# EAGLE design switch-eval (EAGLE 9.5.1)
AUTHOR: Krishna Makhija
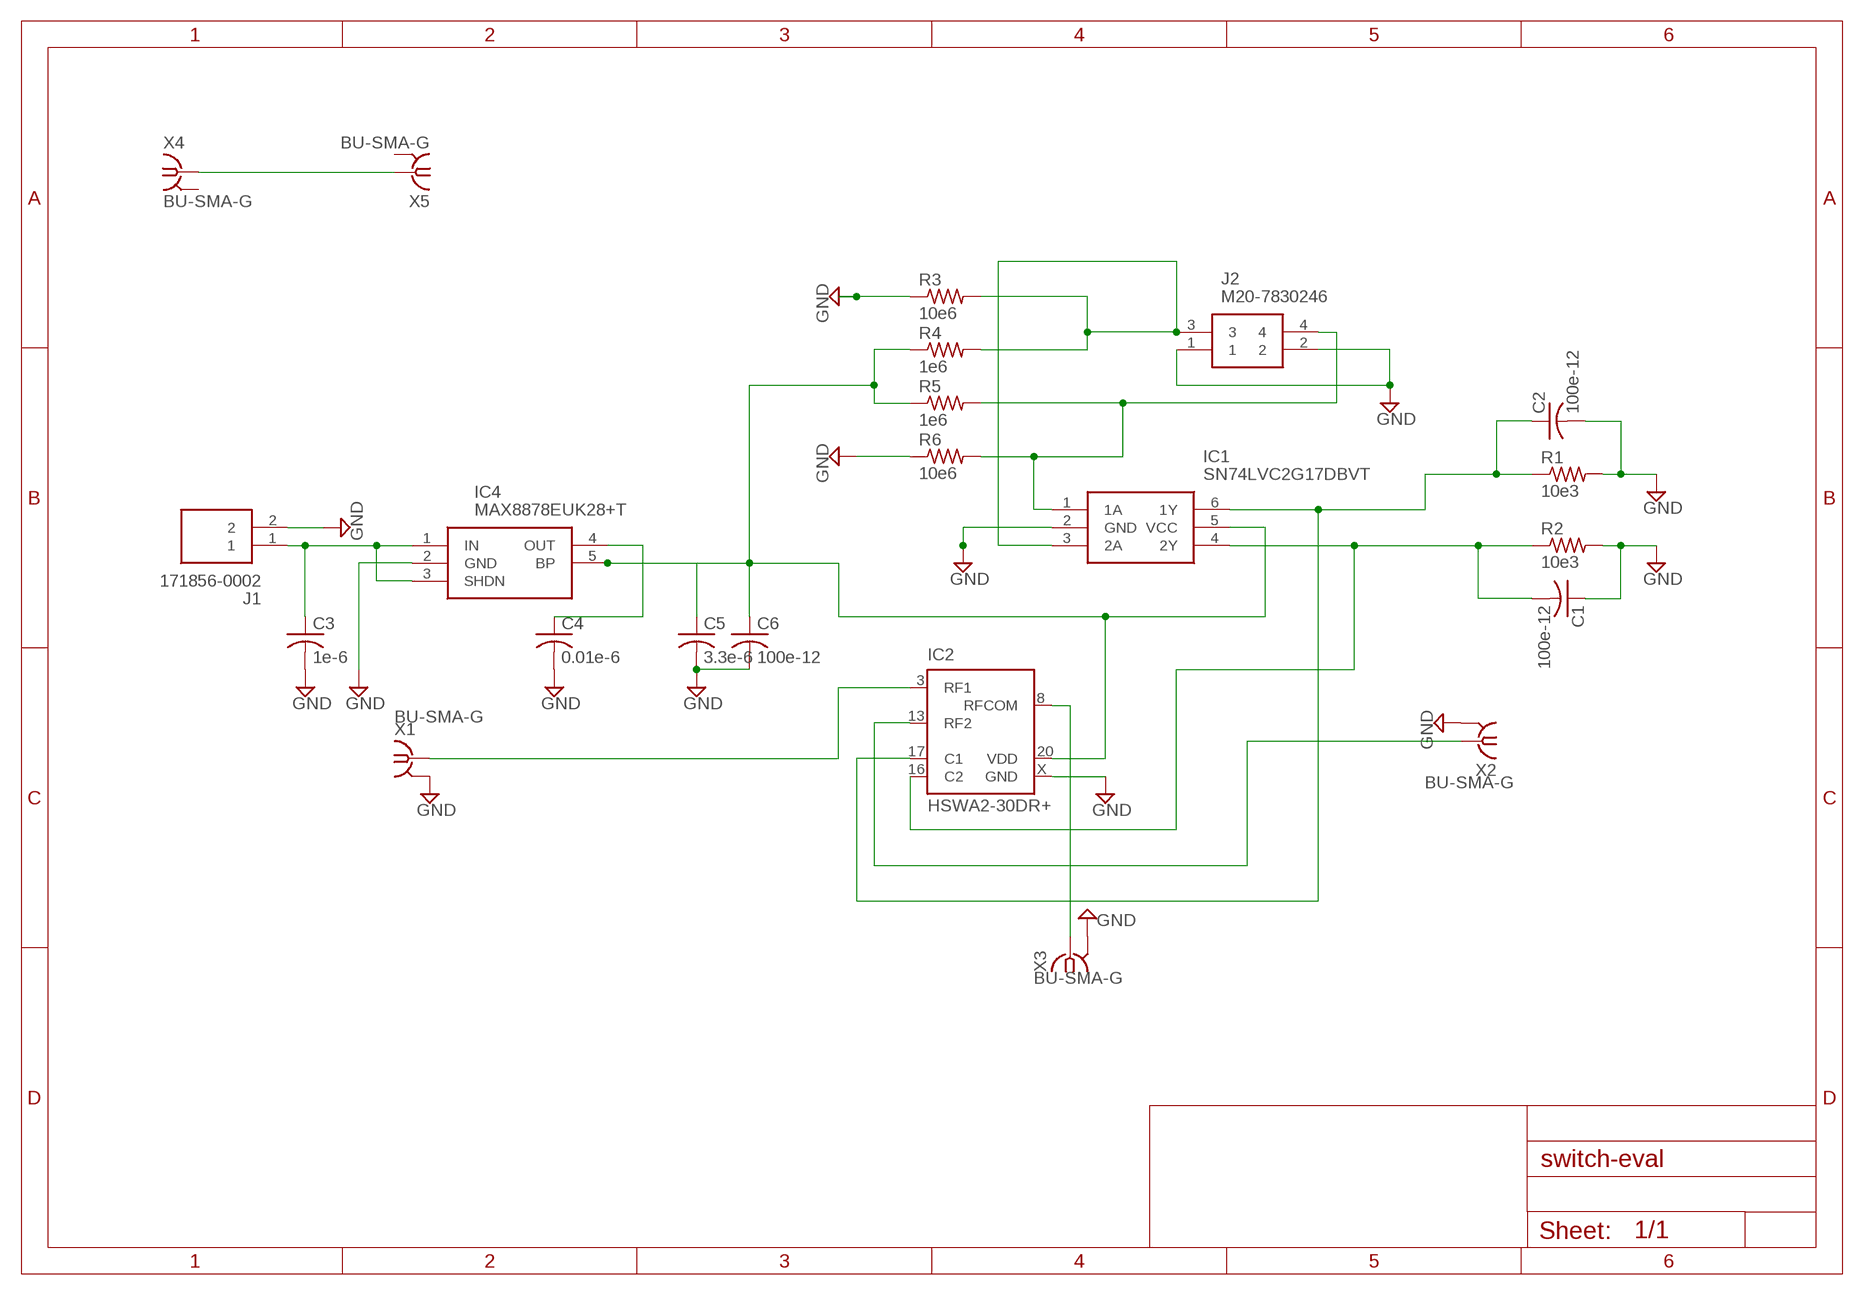
[diagram p0: schematic, sheet 1]

## Parts
C1  100e-12  C-USC0603  [C0603]
C2  100e-12  C-USC0603  [C0603]
C3  1e-6  C-USC0603  [C0603]
C4  0.01e-6  C-USC0603  [C0603]
C5  3.3e-6  C-USC0603  [C0603]
C6  100e-12  C-USC0603  [C0603]
IC1  SN74LVC2G17DBVT  [SOT95P280X145-6N]
IC2  HSWA2-30DR+  [DG983-1]
IC4  MAX8878EUK28+T  [SOT95P280X145-5N]
J1  171856-0002  [SHDR2W90P0X254_1X2_493X635X106]
J2  M20-7830246  [M207830246]
R1  10e3  R-US_R0603  [R0603]
R2  10e3  R-US_R0603  [R0603]
R3  10e6  R-US_R0603  [R0603]
R4  1e6  R-US_R0603  [R0603]
R5  1e6  R-US_R0603  [R0603]
R6  10e6  R-US_R0603  [R0603]
X1  BU-SMA-G  [BU-SMA-G]
X2  BU-SMA-G  [BU-SMA-G]
X3  BU-SMA-G  [BU-SMA-G]
X4  BU-SMA-G  [BU-SMA-G]
X5  BU-SMA-G  [BU-SMA-G]

## Nets
GND: C1.1 C2.2 C3.2 C4.2 C5.2 C6.2 IC1.2(GND) IC2.X(GND) IC4.2(GND) J1.2 J2.1 J2.2 R1.2 R2.2 R3.1 R6.1 X1.2 X1.3 X1.4 X1.5 X2.2 X2.3 X2.4 X2.5 X3.2 X3.3 X3.4 X3.5
N$1: IC1.3(2A) J2.3 R3.2 R4.2
N$2: C3.1 IC4.1(IN) IC4.3(SHDN) J1.1
N$3: C4.1 IC4.4(OUT)
N$4: IC1.1(1A) J2.4 R5.2 R6.2
N$5: X4.1 X5.1
N$7: C5.1 C6.1 IC1.5(VCC) IC2.20(VDD) IC4.5(BP) R4.1 R5.1
N$8: IC2.3(RF1) X1.1
N$9: C2.1 IC1.6(1Y) IC2.17(C1) R1.1
N$10: IC2.13(RF2) X2.1
N$11: C1.2 IC1.4(2Y) IC2.16(C2) R2.1
N$12: IC2.8(RFCOM) X3.1
Unconnected: X4.2 X4.3 X4.4 X4.5 X5.2 X5.3 X5.4 X5.5

## Power pins joined to a net without a drawn wire
GND: IC2.1(GND) IC2.2(GND) IC2.4(GND) IC2.5(GND) IC2.6(GND) IC2.7(GND) IC2.9(GND) IC2.10(GND) IC2.11(GND) IC2.12(GND) IC2.14(GND) IC2.15(GND) IC2.18(GND) IC2.19(GND)

## Library data of the parts
C1-C6 = rcl:C-US: CAPACITOR, American symbol; SPICEPREFIX: C
IC1 = SN74LVC2G17DBVT:SN74LVC2G17DBVT: DUAL SCHMITT-TRIGGER BUFFER Source: Datasheet <http://www.ti.com/lit/gpn/SN74LVC2G17>; DESCRIPTION: DUAL SCHMITT-TRIGGER BUFFER; HEIGHT: 1.45mm; MANUFACTURER_NAME: Texas Instruments; MANUFACTURER_PART_NUMBER: SN74LVC2G17DBVT; MOUSER_PART_NUMBER: 595-SN74LVC2G17DBVT; MOUSER_PRICE-STOCK: https://www.mouser.com/Search/Refine.aspx?Keyword=595-SN74LVC2G17DBVT; RS_PART_NUMBER: 6628944P; RS_PRICE-STOCK: http://uk.rs-online.com/web/p/products/6628944P
IC2 = minicircuits:HSWA2-30DR+: SPDT RF SWITCH Absorptive RF Switch with internal driver Source: http://www.minicircuits.com .. HSWA2-30DR+.pdf; OC_FARNELL: unknown; OC_NEWARK: unknown
IC4 = MAX8878EUK28+T:MAX8878EUK28+T: LDO Voltage Regulators Low-Noise, Low-Dropout, 150mA Linear Regulators with 2982 Pinout Source: Datasheet <https://www.mouser.com/datasheet/2/256/MAX8878-1389229.pdf>; DESCRIPTION: LDO Voltage Regulators Low-Noise, Low-Dropout, 150mA Linear Regulators with 2982 Pinout; HEIGHT: 1.45mm; MANUFACTURER_NAME: Maxim Integrated; MANUFACTURER_PART_NUMBER: MAX8878EUK28+T
J1 = 171856-0002:171856-0002: KK 254 RPC Pin Header friction lock 2way Molex KK 254 Series, Series Number 171856, 2.54mm Pitch 2 Way 1 Row Straight PCB Header, Through Hole Source: Datasheet <https://www.digikey.com/product-detail/en/molex/1718560002/WM10153-ND/4423109>; ALLIED_NUMBER: 70314268; ALLIED_PRICE-STOCK: https://www.alliedelec.com/molexincorporated-171856-0002/70314268/; DESCRIPTION: KK 254 RPC Pin Header friction lock 2way Molex KK 254 Series, Series Number 171856, 2.54mm Pitch 2 Way 1 Row Straight PCB Header, Through Hole; HEIGHT: 10.61mm; MANUFACTURER_NAME: Molex; MANUFACTURER_PART_NUMBER: 171856-0002; MOUSER_PART_NUMBER: 538-171856-0002; MOUSER_PRICE-STOCK: https://www.mouser.com/Search/Refine.aspx?Keyword=538-171856-0002; RS_PART_NUMBER: 7922884P; RS_PRICE-STOCK: http://uk.rs-online.com/web/p/products/7922884P
J2 = M20-7830246:M20-7830246: HARWIN 2.54mm 4 Way 2 Row Straight PCB Socket Through Hole Socket Strip Source: Datasheet <https://cdn.harwin.com/pdfs/M20-783.pdf>; ALLIED_NUMBER: R1052762; ALLIED_PRICE-STOCK: https://www.alliedelec.com/harwin-m20-7830246/R1052762/; DESCRIPTION: HARWIN 2.54mm 4 Way 2 Row Straight PCB Socket Through Hole Socket Strip; HEIGHT: 8.65mm; MANUFACTURER_NAME: HARWIN; MANUFACTURER_PART_NUMBER: M20-7830246; MOUSER_PART_NUMBER: 855-M20-7830246; MOUSER_PRICE-STOCK: https://www.mouser.com/Search/Refine.aspx?Keyword=855-M20-7830246; RS_PART_NUMBER: 6816839P; RS_PRICE-STOCK: http://uk.rs-online.com/web/p/products/6816839P
R1-R6 = rcl:R-US_: RESISTOR, American symbol; SPICEPREFIX: R
X1-X5 = con-coax:BU-SMA-G: FEMALE SMA CONNECTOR Radiall distributor RS 193-9117; OC_FARNELL: unknown; OC_NEWARK: unknown

## Board
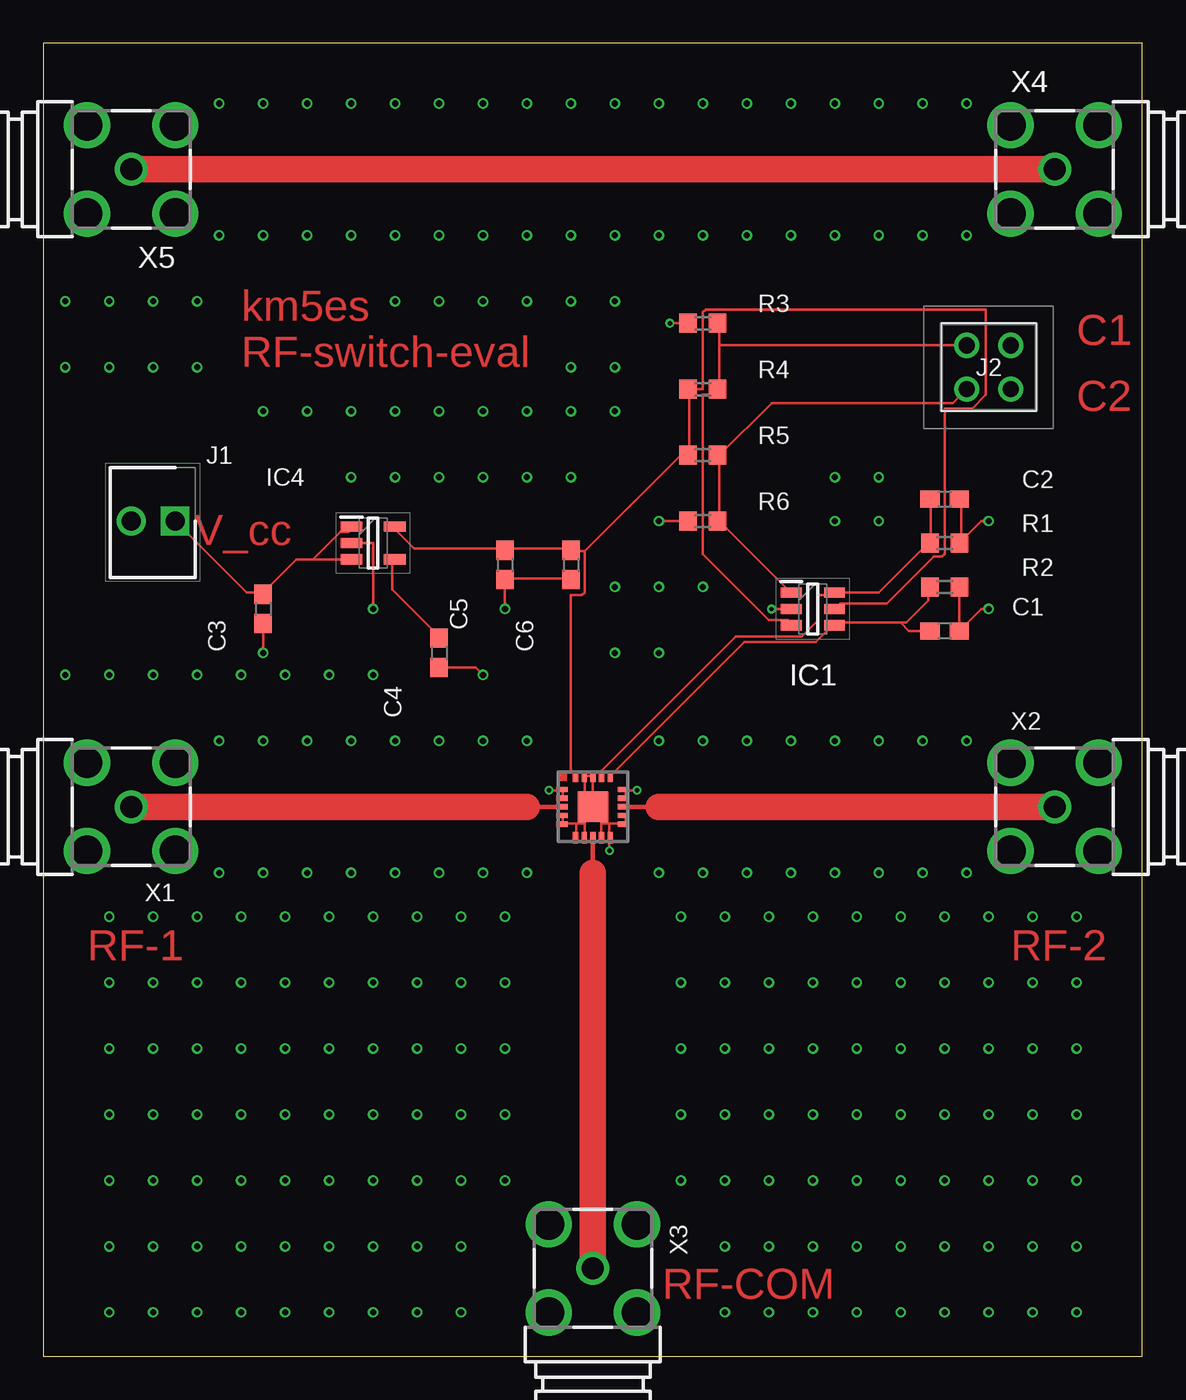
[diagram p1: board, top side]
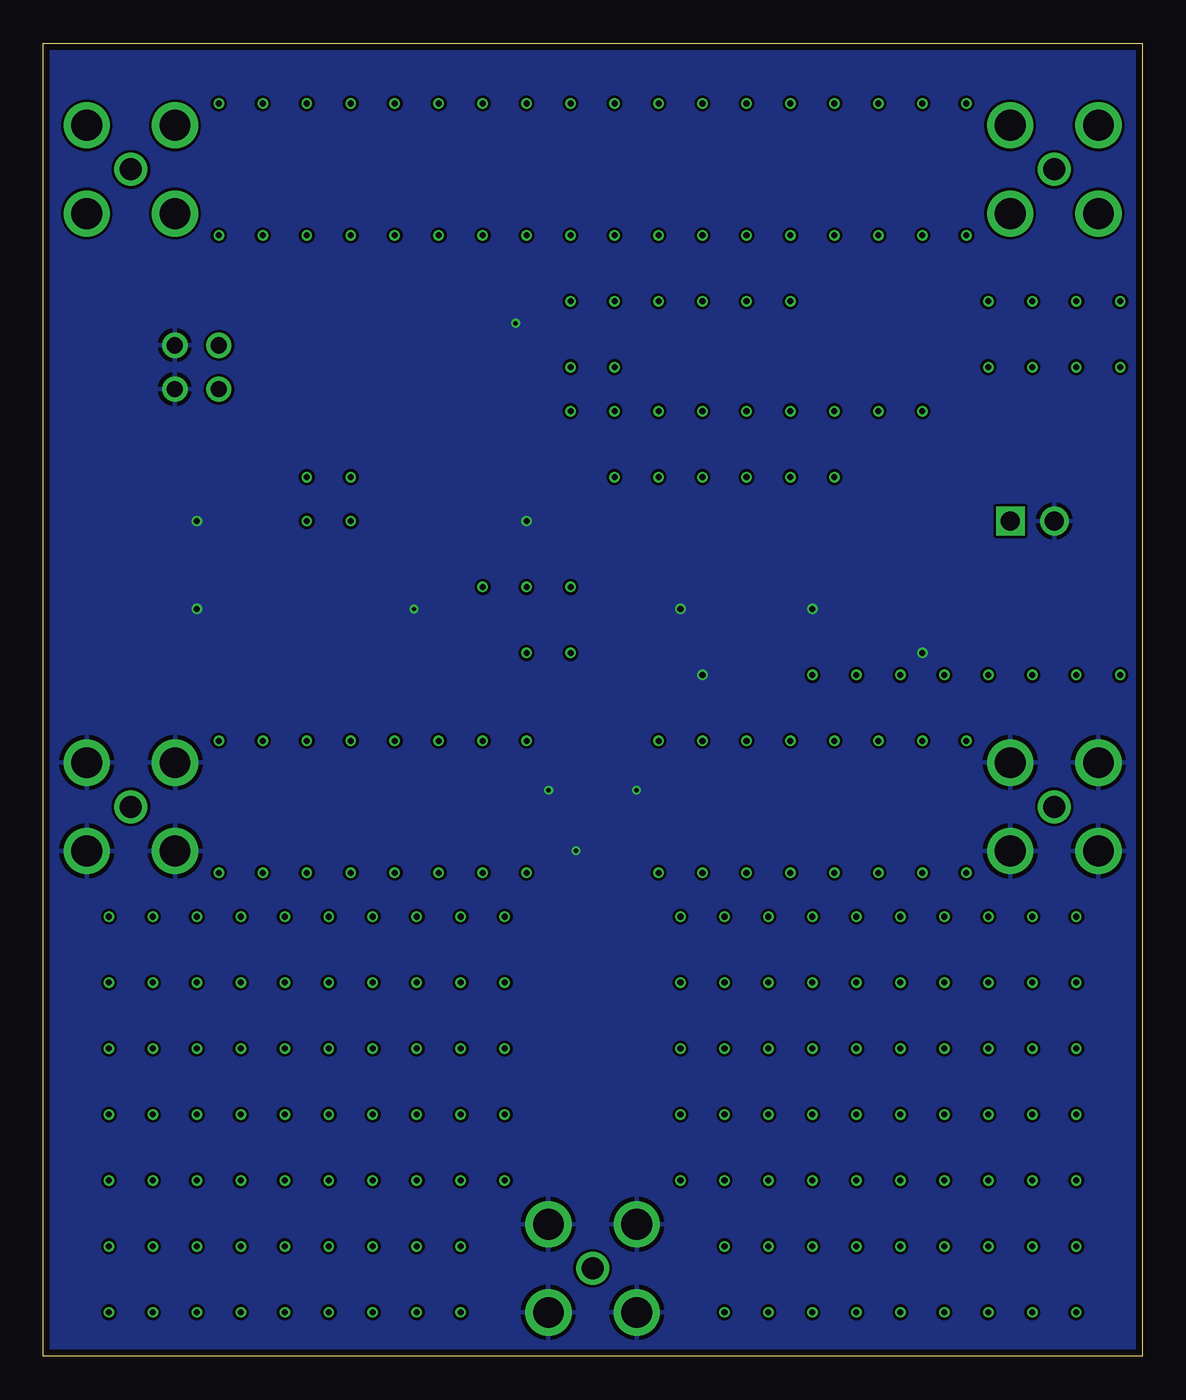
[diagram p2: board, bottom side, seen from below]

Size 63.48 x 75.87 mm. Coordinates in mm from the lower left corner, seen from the top.
Outline: 0,0 63.48,0 63.48,75.87 0,75.87 0,0
Copper layers (1*16): Top 0.035559375mm / dielectric 1.6mm / Bottom 0.035559375mm
Design rules "oshpark-2layer": minimum track width 6mil, minimum drill 10mil, track to track 6mil, track to pad 6mil, pad to pad 6mil, via to via 6mil, smd to smd 6mil, copper to edge 15mil, drill to drill 6mil, minimum pad ring 5mil, minimum via ring 5mil, stop-mask expansion 2.5mil, vias tented up to drill 0mil, thermal gap 10mil

### Footprints (pad centres in the part's own frame; a part is rotated, then mirrored left to right if it is on the bottom)
C0603 = smd 1.1 x 1: 1 -0.85,0; 2 0.85,0
SOT95P280X145-6N = smd 1.2 x 0.6: 1 -1.25,0.95; 2 -1.25,0; 3 -1.25,-0.95; 4 1.25,-0.95; 5 1.25,0; 6 1.25,0.95
DG983-1 = smd 0.66 x 0.31: 1 -1.775,1; 2 -1.775,0.5; 3 -1.775,0; 4 -1.775,-0.5; 5 -1.775,-1; 11 1.775,-1; 12 1.775,-0.5; 13 1.775,0; 14 1.775,0.5; 15 1.775,1 | smd 0.31 x 0.66: 6 -1,-1.775; 7 -0.5,-1.775; 8 0,-1.775; 9 0.5,-1.775; 10 1,-1.775; 16 1,1.775; 17 0.5,1.775; 18 0,1.775; 19 -0.5,1.775; 20 -1,1.775 | smd 1.78 x 1.78: X 0,0
SOT95P280X145-5N = smd 1.25 x 0.6: 1 -1.25,0.95; 2 -1.25,0; 3 -1.25,-0.95; 4 1.25,-0.95; 5 1.25,0.95
SHDR2W90P0X254_1X2_493X635X106 = drill 1.1 pad 1.65 square: 1 0,0 | drill 1.1 pad 1.65: 2 2.54,0
M207830246 = drill 0.94 pad 1.462: 1 -1.27,-1.27; 2 -1.27,1.27; 3 1.27,-1.27; 4 1.27,1.27
R0603 = smd 1 x 1.1: 1 -0.85,0; 2 0.85,0
BU-SMA-G = drill 1.27: 1 0,0 | drill 1.778: 2 -2.55,2.55; 3 2.55,2.55; 4 2.55,-2.55; 5 -2.55,-2.55

### Placement (x,y rotation side)
C1  52.07,41.91 180 top
C2  52.07,49.53 0 top
C3  12.7,43.18 270 top
C4  22.86,40.64 270 top
C5  26.67,45.72 270 top
C6  30.48,45.72 270 top
IC1  44.45,43.18 0 top
IC2  31.75,31.75 0 top
IC4  19.05,46.99 0 top
J1  7.62,48.26 180 top
J2  54.61,57.15 180 top
R1  52.07,46.99 0 top
R2  52.07,44.45 0 top
R3  38.1,59.69 0 top
R4  38.1,55.88 0 top
R5  38.1,52.07 0 top
R6  38.1,48.26 0 top
X1  5.08,31.75 180 top
X2  58.42,31.75 0 top
X3  31.75,5.08 270 top
X4  58.42,68.58 0 top
X5  5.08,68.58 180 top

### Tracks (layer width: path | path; a pad name or v marks a point on that pad's centre or on a via)
GND  (via drill 0.25, 0.35)
  Top 0.152: IC2.12 33.66,31.11 33.66,30.8 IC2.11 33.5,30.8 32.7,30.8 | 32.7,30.8 32.7,30 IC2.10 32.7,29.84 v32.7,29.21 | 30,30.8 30,31.11 IC2.4 | 30.8,30.8 30.8,30 IC2.6 | 30,30.8 30.8,30.8 | 30,30.8 IC2.5 | IC2.X IC2.18 IC2.19 31.27,33.5 31.27,31.75 | 31.27,31.75 31.27,30.8 | 31.27,30.8 31.27,30 IC2.7 | 32.23,30.8 32.23,31.75 IC2.X | 32.23,30.8 32.23,30 IC2.9 | 31.27,31.75 IC2.X | 31.27,30.8 30.8,30.8 | 32.23,30.8 32.7,30.8 | 33.66,32.7 33.66,32.38 IC2.14 | IC2.2 30,32.38 30,32.7 IC2.1 29.84,32.7 v29.21,32.7 | v34.29,32.7 33.66,32.7 | 33.66,32.7 IC2.15 | 12.7,42.23 C3.2 v12.7,40.64 | 22.86,39.85 C4.2 24.98,39.79 v25.4,39.37 | C6.2 30.48,44.93 26.67,44.93 C5.2 v26.67,43.18 | 17.94,46.99 IC4.2 19.05,46.99 v19.05,43.18 | 53.02,49.53 C2.2 53.02,49.43 53.02,47.09 R1.2 54.19,48.26 v54.61,48.26 | 53.02,44.45 R2.2 C1.1 54.19,43.18 v54.61,43.18 | 37.15,48.26 R6.1 v35.56,48.26 | v36.2,59.69 R3.1 | v42.07,43.18 IC1.2
  pour Bottom: 0,76.2 63.5,76.2 63.5,0 0,0
N$1
  Top 0.152: 39.05,58.42 39.05,59.69 R3.2 | 39.05,58.42 39.05,55.88 R4.2 38.89,55.88 38.58,55.56 38.1,55.56 38.1,46.35 41.91,42.55 43.02,42.55 43.18,42.39 IC1.3 | 39.05,58.42 J2.3
N$2
  Top 0.152: 12.7,44.13 14.61,46.04 15.56,46.04 | 15.56,46.04 17.78,46.04 IC4.3 | 15.56,46.04 17.14,47.62 17.62,47.62 17.78,47.78 IC4.1 | J1.1 11.75,44.13 12.7,44.13 | 12.7,44.13 C3.1
N$3
  Top 0.152: C4.1 22.86,41.59 20.16,44.29 20.16,46.04 IC4.4
N$4
  Top 0.152: 39.05,52.07 39.05,48.26 | 39.05,48.26 43.18,44.13 IC1.1 | 39.05,48.26 R6.2 | J2.4 52.55,55.09 42.07,55.09 39.05,52.07 | 39.05,52.07 R5.2
N$5
  Top 1.524: X5.1 X4.1
N$6  (via drill 0.35)
  other vias: 10.16,27.94
N$7
  Top 0.152: IC2.20 30.64,33.66 30.48,33.81 30.48,43.97 31.11,43.97 31.27,44.13 31.27,46.51 | 31.27,46.51 30.48,46.51 C6.1 30.48,46.67 26.67,46.67 | 26.67,46.67 21.43,46.67 20.32,47.78 IC4.5 | 26.67,46.67 C5.1 | 37.31,55.88 37.31,52.07 R5.1 36.83,52.07 31.27,46.51 | 37.31,55.88 38.1,55.88 38.1,60.33 38.26,60.48 54.45,60.48 54.45,55.56 53.66,54.77 52.07,54.77 52.07,46.35 51.91,46.2 51.44,46.2 48.74,43.5 46.04,43.5 45.72,43.18 IC1.5 | 37.31,55.88 R4.1
N$8
  Top 0.254: IC2.3 27.94,31.75
  Top 1.524: 27.94,31.75 X1.1
N$9
  Top 0.152: 32.23,33.81 32.23,33.66 IC2.17 32.23,33.81 | C2.1 51.28,49.53 51.28,46.99 R1.1 51.12,46.99 48.26,44.13 45.72,44.13 IC1.6 45.56,43.97 44.77,43.97 44.77,42.55 43.81,41.59 40.01,41.59 32.23,33.81
N$10
  Top 0.254: IC2.13 35.56,31.75
  Top 1.524: 35.56,31.75 X2.1
N$11
  Top 0.152: R2.1 51.12,44.45 51.12,43.66 49.85,42.39 49.53,42.39 | IC2.16 32.86,33.66 40.48,41.27 44.61,41.27 45.56,42.23 IC1.4 45.72,42.39 49.53,42.39 | C1.2 50.01,41.91 49.53,42.39
N$12
  Top 0.254: 31.75,27.94 IC2.8
  Top 1.524: X3.1 31.75,27.94
N$13  (via drill 0.35)
  other vias: 12.7,27.94
N$14  (via drill 0.35)
  other vias: 15.24,27.94
N$15  (via drill 0.35)
  other vias: 17.78,27.94
N$16  (via drill 0.35)
  other vias: 20.32,27.94
N$17  (via drill 0.35)
  other vias: 22.86,27.94
N$18  (via drill 0.35)
  other vias: 25.4,27.94
N$19  (via drill 0.35)
  other vias: 27.94,27.94
N$20  (via drill 0.35)
  other vias: 1.27,60.96
N$21  (via drill 0.35)
  other vias: 3.81,25.4
N$22  (via drill 0.35)
  other vias: 6.35,25.4
N$23  (via drill 0.35)
  other vias: 8.89,25.4
N$24  (via drill 0.35)
  other vias: 11.43,25.4
N$25  (via drill 0.35)
  other vias: 13.97,25.4
N$26  (via drill 0.35)
  other vias: 16.51,25.4
N$27  (via drill 0.35)
  other vias: 19.05,25.4
N$28  (via drill 0.35)
  other vias: 3.81,60.96
N$29  (via drill 0.35)
  other vias: 3.81,21.59
N$30  (via drill 0.35)
  other vias: 6.35,21.59
N$31  (via drill 0.35)
  other vias: 8.89,21.59
N$32  (via drill 0.35)
  other vias: 11.43,21.59
N$33  (via drill 0.35)
  other vias: 13.97,21.59
N$34  (via drill 0.35)
  other vias: 16.51,21.59
N$35  (via drill 0.35)
  other vias: 19.05,21.59
N$36  (via drill 0.35)
  other vias: 6.35,60.96
N$37  (via drill 0.35)
  other vias: 3.81,17.78
N$38  (via drill 0.35)
  other vias: 6.35,17.78
N$39  (via drill 0.35)
  other vias: 8.89,17.78
N$40  (via drill 0.35)
  other vias: 11.43,17.78
N$41  (via drill 0.35)
  other vias: 13.97,17.78
N$42  (via drill 0.35)
  other vias: 16.51,17.78
N$43  (via drill 0.35)
  other vias: 19.05,17.78
N$44  (via drill 0.35)
  other vias: 8.89,60.96
N$45  (via drill 0.35)
  other vias: 3.81,13.97
N$46  (via drill 0.35)
  other vias: 6.35,13.97
N$47  (via drill 0.35)
  other vias: 8.89,13.97
N$48  (via drill 0.35)
  other vias: 11.43,13.97
N$49  (via drill 0.35)
  other vias: 13.97,13.97
N$50  (via drill 0.35)
  other vias: 16.51,13.97
N$51  (via drill 0.35)
  other vias: 19.05,13.97
N$52  (via drill 0.35)
  other vias: 1.27,57.15
N$53  (via drill 0.35)
  other vias: 3.81,10.16
N$54  (via drill 0.35)
  other vias: 6.35,10.16
N$55  (via drill 0.35)
  other vias: 8.89,10.16
N$56  (via drill 0.35)
  other vias: 11.43,10.16
N$57  (via drill 0.35)
  other vias: 13.97,10.16
N$58  (via drill 0.35)
  other vias: 16.51,10.16
N$59  (via drill 0.35)
  other vias: 19.05,10.16
N$60  (via drill 0.35)
  other vias: 3.81,57.15
N$61  (via drill 0.35)
  other vias: 3.81,6.35
N$62  (via drill 0.35)
  other vias: 6.35,6.35
N$63  (via drill 0.35)
  other vias: 8.89,6.35
N$64  (via drill 0.35)
  other vias: 11.43,6.35
N$65  (via drill 0.35)
  other vias: 13.97,6.35
N$66  (via drill 0.35)
  other vias: 16.51,6.35
N$67  (via drill 0.35)
  other vias: 19.05,6.35
N$68  (via drill 0.35)
  other vias: 6.35,57.15
N$69  (via drill 0.35)
  other vias: 3.81,2.54
N$70  (via drill 0.35)
  other vias: 6.35,2.54
N$71  (via drill 0.35)
  other vias: 8.89,2.54
N$72  (via drill 0.35)
  other vias: 11.43,2.54
N$73  (via drill 0.35)
  other vias: 13.97,2.54
N$74  (via drill 0.35)
  other vias: 16.51,2.54
N$75  (via drill 0.35)
  other vias: 19.05,2.54
N$76  (via drill 0.35)
  other vias: 21.59,25.4
N$77  (via drill 0.35)
  other vias: 21.59,21.59
N$78  (via drill 0.35)
  other vias: 21.59,17.78
N$79  (via drill 0.35)
  other vias: 21.59,13.97
N$80  (via drill 0.35)
  other vias: 21.59,10.16
N$81  (via drill 0.35)
  other vias: 21.59,6.35
N$82  (via drill 0.35)
  other vias: 21.59,2.54
N$83  (via drill 0.35)
  other vias: 24.13,25.4
N$84  (via drill 0.35)
  other vias: 24.13,21.59
N$85  (via drill 0.35)
  other vias: 24.13,17.78
N$86  (via drill 0.35)
  other vias: 24.13,13.97
N$87  (via drill 0.35)
  other vias: 24.13,10.16
N$88  (via drill 0.35)
  other vias: 24.13,6.35
N$89  (via drill 0.35)
  other vias: 24.13,2.54
N$90  (via drill 0.35)
  other vias: 26.67,25.4
N$91  (via drill 0.35)
  other vias: 26.67,21.59
N$92  (via drill 0.35)
  other vias: 26.67,17.78
N$93  (via drill 0.35)
  other vias: 26.67,13.97
N$94  (via drill 0.35)
  other vias: 26.67,10.16
N$95  (via drill 0.35)
  other vias: 35.56,27.94
N$96  (via drill 0.35)
  other vias: 38.1,27.94
N$97  (via drill 0.35)
  other vias: 40.64,27.94
N$98  (via drill 0.35)
  other vias: 43.18,27.94
N$99  (via drill 0.35)
  other vias: 45.72,27.94
N$100  (via drill 0.35)
  other vias: 48.26,27.94
N$101  (via drill 0.35)
  other vias: 50.8,27.94
N$102  (via drill 0.35)
  other vias: 53.34,27.94
N$103  (via drill 0.35)
  other vias: 36.83,25.4
N$104  (via drill 0.35)
  other vias: 36.83,21.59
N$105  (via drill 0.35)
  other vias: 36.83,17.78
N$106  (via drill 0.35)
  other vias: 36.83,13.97
N$107  (via drill 0.35)
  other vias: 36.83,10.16
N$108  (via drill 0.35)
  other vias: 39.37,25.4
N$109  (via drill 0.35)
  other vias: 41.91,25.4
N$110  (via drill 0.35)
  other vias: 44.45,25.4
N$111  (via drill 0.35)
  other vias: 46.99,25.4
N$112  (via drill 0.35)
  other vias: 49.53,25.4
N$113  (via drill 0.35)
  other vias: 52.07,25.4
N$114  (via drill 0.35)
  other vias: 54.61,25.4
N$115  (via drill 0.35)
  other vias: 57.15,25.4
N$116  (via drill 0.35)
  other vias: 39.37,21.59
N$117  (via drill 0.35)
  other vias: 41.91,21.59
N$118  (via drill 0.35)
  other vias: 44.45,21.59
N$119  (via drill 0.35)
  other vias: 46.99,21.59
N$120  (via drill 0.35)
  other vias: 49.53,21.59
N$121  (via drill 0.35)
  other vias: 52.07,21.59
N$122  (via drill 0.35)
  other vias: 54.61,21.59
N$123  (via drill 0.35)
  other vias: 57.15,21.59
N$124  (via drill 0.35)
  other vias: 39.37,17.78
N$125  (via drill 0.35)
  other vias: 41.91,17.78
N$126  (via drill 0.35)
  other vias: 44.45,17.78
N$127  (via drill 0.35)
  other vias: 46.99,17.78
N$128  (via drill 0.35)
  other vias: 49.53,17.78
N$129  (via drill 0.35)
  other vias: 52.07,17.78
N$130  (via drill 0.35)
  other vias: 54.61,17.78
N$131  (via drill 0.35)
  other vias: 57.15,17.78
N$132  (via drill 0.35)
  other vias: 39.37,13.97
N$133  (via drill 0.35)
  other vias: 41.91,13.97
N$134  (via drill 0.35)
  other vias: 44.45,13.97
N$135  (via drill 0.35)
  other vias: 46.99,13.97
N$136  (via drill 0.35)
  other vias: 49.53,13.97
N$137  (via drill 0.35)
  other vias: 52.07,13.97
N$138  (via drill 0.35)
  other vias: 54.61,13.97
N$139  (via drill 0.35)
  other vias: 57.15,13.97
N$140  (via drill 0.35)
  other vias: 39.37,10.16
N$141  (via drill 0.35)
  other vias: 41.91,10.16
N$142  (via drill 0.35)
  other vias: 44.45,10.16
N$143  (via drill 0.35)
  other vias: 46.99,10.16
N$144  (via drill 0.35)
  other vias: 49.53,10.16
N$145  (via drill 0.35)
  other vias: 52.07,10.16
N$146  (via drill 0.35)
  other vias: 54.61,10.16
N$147  (via drill 0.35)
  other vias: 57.15,10.16
N$148  (via drill 0.35)
  other vias: 39.37,6.35
N$149  (via drill 0.35)
  other vias: 41.91,6.35
N$150  (via drill 0.35)
  other vias: 44.45,6.35
N$151  (via drill 0.35)
  other vias: 46.99,6.35
N$152  (via drill 0.35)
  other vias: 49.53,6.35
N$153  (via drill 0.35)
  other vias: 52.07,6.35
N$154  (via drill 0.35)
  other vias: 54.61,6.35
N$155  (via drill 0.35)
  other vias: 57.15,6.35
N$156  (via drill 0.35)
  other vias: 39.37,2.54
N$157  (via drill 0.35)
  other vias: 41.91,2.54
N$158  (via drill 0.35)
  other vias: 44.45,2.54
N$159  (via drill 0.35)
  other vias: 46.99,2.54
N$160  (via drill 0.35)
  other vias: 49.53,2.54
N$161  (via drill 0.35)
  other vias: 52.07,2.54
N$162  (via drill 0.35)
  other vias: 54.61,2.54
N$163  (via drill 0.35)
  other vias: 57.15,2.54
N$164  (via drill 0.35)
  other vias: 59.69,25.4
N$165  (via drill 0.35)
  other vias: 59.69,21.59
N$166  (via drill 0.35)
  other vias: 59.69,17.78
N$167  (via drill 0.35)
  other vias: 59.69,13.97
N$168  (via drill 0.35)
  other vias: 59.69,10.16
N$169  (via drill 0.35)
  other vias: 59.69,6.35
N$170  (via drill 0.35)
  other vias: 59.69,2.54
N$171  (via drill 0.35)
  other vias: 8.89,57.15
N$172  (via drill 0.35)
  other vias: 20.32,60.96
N$173  (via drill 0.35)
  other vias: 22.86,60.96
N$174  (via drill 0.35)
  other vias: 25.4,60.96
N$175  (via drill 0.35)
  other vias: 27.94,60.96
N$176  (via drill 0.35)
  other vias: 12.7,54.61
N$177  (via drill 0.35)
  other vias: 15.24,54.61
N$178  (via drill 0.35)
  other vias: 10.16,35.56
N$179  (via drill 0.35)
  other vias: 12.7,35.56
N$180  (via drill 0.35)
  other vias: 15.24,35.56
N$181  (via drill 0.35)
  other vias: 17.78,35.56
N$182  (via drill 0.35)
  other vias: 20.32,35.56
N$183  (via drill 0.35)
  other vias: 22.86,35.56
N$184  (via drill 0.35)
  other vias: 25.4,35.56
N$185  (via drill 0.35)
  other vias: 27.94,35.56
N$186  (via drill 0.35)
  other vias: 35.56,35.56
N$187  (via drill 0.35)
  other vias: 38.1,35.56
N$188  (via drill 0.35)
  other vias: 40.64,35.56
N$189  (via drill 0.35)
  other vias: 43.18,35.56
N$190  (via drill 0.35)
  other vias: 45.72,35.56
N$191  (via drill 0.35)
  other vias: 48.26,35.56
N$192  (via drill 0.35)
  other vias: 50.8,35.56
N$193  (via drill 0.35)
  other vias: 53.34,35.56
N$194  (via drill 0.35)
  other vias: 10.16,72.39
N$195  (via drill 0.35)
  other vias: 12.7,72.39
N$196  (via drill 0.35)
  other vias: 15.24,72.39
N$197  (via drill 0.35)
  other vias: 17.78,72.39
N$198  (via drill 0.35)
  other vias: 20.32,72.39
N$199  (via drill 0.35)
  other vias: 22.86,72.39
N$200  (via drill 0.35)
  other vias: 25.4,72.39
N$201  (via drill 0.35)
  other vias: 27.94,72.39
N$202  (via drill 0.35)
  other vias: 30.48,72.39
N$203  (via drill 0.35)
  other vias: 33.02,72.39
N$204  (via drill 0.35)
  other vias: 35.56,72.39
N$205  (via drill 0.35)
  other vias: 38.1,72.39
N$206  (via drill 0.35)
  other vias: 40.64,72.39
N$207  (via drill 0.35)
  other vias: 43.18,72.39
N$208  (via drill 0.35)
  other vias: 45.72,72.39
N$209  (via drill 0.35)
  other vias: 48.26,72.39
N$210  (via drill 0.35)
  other vias: 10.16,64.77
N$211  (via drill 0.35)
  other vias: 12.7,64.77
N$212  (via drill 0.35)
  other vias: 15.24,64.77
N$213  (via drill 0.35)
  other vias: 17.78,64.77
N$214  (via drill 0.35)
  other vias: 20.32,64.77
N$215  (via drill 0.35)
  other vias: 22.86,64.77
N$216  (via drill 0.35)
  other vias: 25.4,64.77
N$217  (via drill 0.35)
  other vias: 27.94,64.77
N$218  (via drill 0.35)
  other vias: 30.48,64.77
N$219  (via drill 0.35)
  other vias: 33.02,64.77
N$220  (via drill 0.35)
  other vias: 35.56,64.77
N$221  (via drill 0.35)
  other vias: 38.1,64.77
N$222  (via drill 0.35)
  other vias: 40.64,64.77
N$223  (via drill 0.35)
  other vias: 43.18,64.77
N$224  (via drill 0.35)
  other vias: 45.72,64.77
N$225  (via drill 0.35)
  other vias: 48.26,64.77
N$226  (via drill 0.35)
  other vias: 50.8,72.39
N$227  (via drill 0.35)
  other vias: 53.34,72.39
N$228  (via drill 0.35)
  other vias: 50.8,64.77
N$229  (via drill 0.35)
  other vias: 53.34,64.77
N$230  (via drill 0.35)
  other vias: 17.78,54.61
N$231  (via drill 0.35)
  other vias: 20.32,54.61
N$232  (via drill 0.35)
  other vias: 22.86,54.61
N$233  (via drill 0.35)
  other vias: 25.4,54.61
N$234  (via drill 0.35)
  other vias: 27.94,54.61
N$235  (via drill 0.35)
  other vias: 30.48,54.61
N$236  (via drill 0.35)
  other vias: 1.27,39.37
N$237  (via drill 0.35)
  other vias: 3.81,39.37
N$238  (via drill 0.35)
  other vias: 6.35,39.37
N$239  (via drill 0.35)
  other vias: 8.89,39.37
N$240  (via drill 0.35)
  other vias: 11.43,39.37
N$241  (via drill 0.35)
  other vias: 13.97,39.37
N$242  (via drill 0.35)
  other vias: 16.51,39.37
N$243  (via drill 0.35)
  other vias: 19.05,39.37
N$244  (via drill 0.35)
  other vias: 30.48,60.96
N$245  (via drill 0.35)
  other vias: 33.02,60.96
N$246  (via drill 0.35)
  other vias: 33.02,54.61
N$247  (via drill 0.35)
  other vias: 30.48,57.15
N$248  (via drill 0.35)
  other vias: 33.02,57.15
N$249  (via drill 0.35)
  other vias: 17.78,50.8
N$250  (via drill 0.35)
  other vias: 20.32,50.8
N$251  (via drill 0.35)
  other vias: 22.86,50.8
N$252  (via drill 0.35)
  other vias: 25.4,50.8
N$253  (via drill 0.35)
  other vias: 27.94,50.8
N$254  (via drill 0.35)
  other vias: 30.48,50.8
N$255  (via drill 0.35)
  other vias: 33.02,44.45
N$256  (via drill 0.35)
  other vias: 35.56,44.45
N$257  (via drill 0.35)
  other vias: 38.1,44.45
N$258  (via drill 0.35)
  other vias: 33.02,40.64
N$259  (via drill 0.35)
  other vias: 35.56,40.64
N$260  (via drill 0.35)
  other vias: 45.72,50.8
N$261  (via drill 0.35)
  other vias: 48.26,50.8
N$262  (via drill 0.35)
  other vias: 45.72,48.26
N$263  (via drill 0.35)
  other vias: 48.26,48.26

### Text on the board
Top: C1 | km5es / RF-switch-eval | C2 | V_cc | RF-1 | RF-2 | RF-COM